# Altium schematic sheet Computation.SchDoc
size A4; SheetNumber: 1; SheetTotal: 2
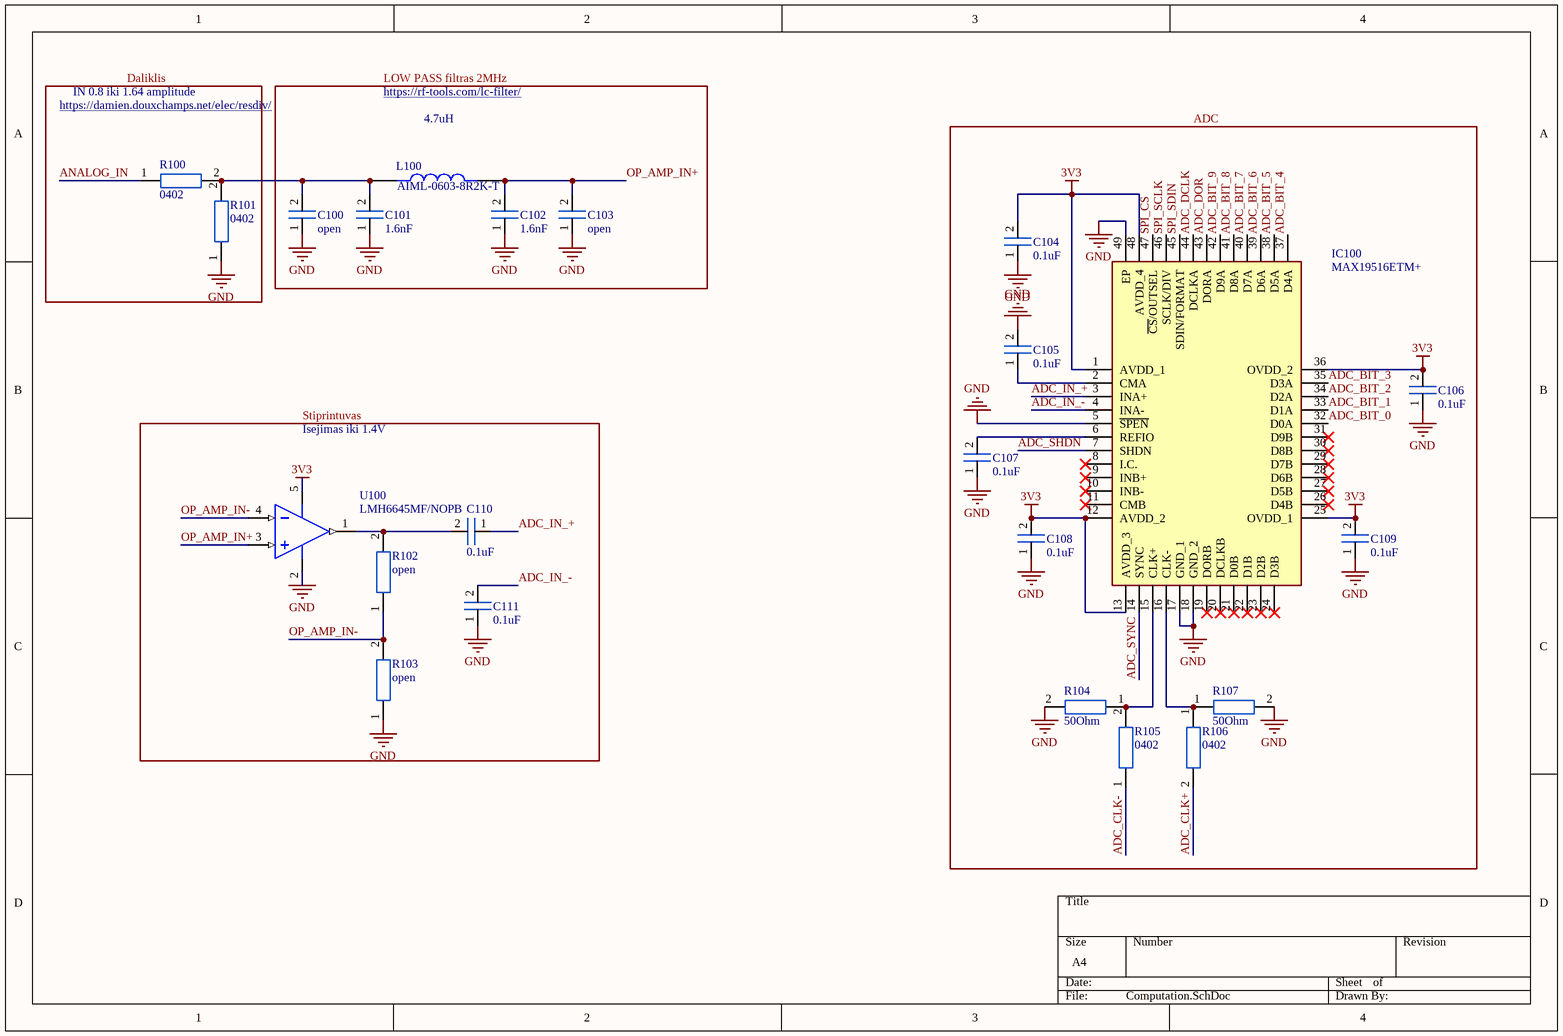
[diagram p0: Computation.SchDoc]

## Parts
C100  open  [0402_footprint]
C101  1.6nF  [0402_footprint]
C102  1.6nF  [0402_footprint]
C103  open  [0402_footprint]
C104  0.1uF  [0402_footprint]
C105  0.1uF  [0402_footprint]
C106  0.1uF  [0402_footprint]
C107  0.1uF  [0402_footprint]
C108  0.1uF  [0402_footprint]
C109  0.1uF  [0402_footprint]
C110  0.1uF  [0402_footprint]
C111  0.1uF  [0402_footprint]
IC100  MAX19516ETM+  [QFN50P700X700X80-49N]
L100  AIML-0603-8R2K-T  [INDC1608X95N]
R100  0402  [0402_footprint]
R101  0402  [0402_footprint]
R102  open  [0402_footprint]
R103  open  [0402_footprint]
R104  50Ohm  [0402_footprint]
R105  0402  [0402_footprint]
R106  0402  [0402_footprint]
R107  50Ohm  [0402_footprint]
U100  LMH6645MF/NOPB  [DBV0005A_N]

## Blocks framed on the sheet
ADC: C104-C109 IC100 R104-R107

## Nets
3V3: C104.2 C106.2 C108.2 C109.2 IC100.1(AVDD_1) IC100.12(AVDD_2) IC100.13(AVDD_3) IC100.25(OVDD_1) IC100.36(OVDD_2) IC100.48(AVDD_4) U100.5(V+)
GND: C100.1 C101.1 C102.1 C103.1 C104.1 C105.2 C106.1 C107.1 C108.1 C109.1 C111.1 IC100.5(~{SPEN}) IC100.17(GND_1) IC100.18(GND_2) IC100.49(EP) R101.1 R103.1 R104.2 R107.2 U100.2(V-)
ADC_BIT_0: IC100.32(D0A)
ADC_BIT_1: IC100.33(D1A)
ADC_BIT_2: IC100.34(D2A)
ADC_BIT_3: IC100.35(D3A)
ADC_BIT_4: IC100.37(D4A)
ADC_BIT_5: IC100.38(D5A)
ADC_BIT_6: IC100.39(D6A)
ADC_BIT_7: IC100.40(D7A)
ADC_BIT_8: IC100.41(D8A)
ADC_BIT_9: IC100.42(D9A)
ADC_CLK+: R106.2
ADC_CLK-: R105.1
ADC_DCLK: IC100.44(DCLKA)
ADC_DOR: IC100.43(DORA)
ADC_IN_+: C110.1 IC100.3(INA+)
ADC_IN_-: C111.2 IC100.4(INA-)
ADC_SHDN: IC100.7(SHDN)
ADC_SYNC: IC100.14(SYNC)
ANALOG_IN: R100.1
OP_AMP_IN+: C102.2 C103.2 L100.2 U100.3(IN+)
OP_AMP_IN-: R102.1 R103.2 U100.4(IN-)
SPI_CS: IC100.47(~{CS}/OUTSEL)
SPI_SCLK: IC100.46(SCLK/DIV)
SPI_SDIN: IC100.45(SDIN/FORMAT)
NetC100_2: C100.2 C101.2 L100.1 R100.2 R101.2
NetC105_1: C105.1 IC100.2(CMA)
NetC107_2: C107.2 IC100.6(REFIO)
NetC110_2: C110.2 R102.2 U100.1(OUT)
NetIC100_15: IC100.15(CLK+) R104.1 R105.2
NetIC100_16: IC100.16(CLK-) R106.1 R107.1

Not connected (* = marked no-connect by the designer): IC100 8(I.C.)* 9(INB+)* 10(INB-)* 11(CMB)* 19(DORB)* 20(DCLKB)* 21(D0B)* 22(D1B)* 23(D2B)* 24(D3B)* 26(D4B)* 27(D5B)* 28(D6B)* 29(D7B)* 30(D8B)* 31(D9B)*

## Notes on the sheet
- https://damien.douxchamps.net/elec/resdiv/
- IN 0.8 iki 1.64 amplitude
- Daliklis
- LOW PASS filtras 2MHz
- https://rf-tools.com/lc-filter/
- 4.7uH
- Isejimas iki 1.4V
- Stiprintuvas

## Library data of the parts
C100-C111 = Capacitor_0402: 0402 capacitor
IC100 = MAX19516ETM+: Integrated Circuit; Manufacturer_Name: Maxim Integrated; Datasheet Link: https://datasheets.maximintegrated.com/en/ds/MAX19516.pdf; Height: 0.8mm; Manufacturer_Part_Number: MAX19516ETM+; Mouser Part Number: 700-MAX19516ETM; Mouser Price/Stock: https://www.mouser.co.uk/ProductDetail/Maxim-Integrated/MAX19516ETM%2b/?qs=1THa7WoU59FJ2JI%2FsSE3dA%3D%3D
L100 = AIML-0603-8R2K-T: 8.2 ÂµH Shielded Multilayer Inductor 4 mA 2.1Ohm Max 0603 (1608 Metric); MF: Abracon; Purchase-URL: https://pricing.snapeda.com/search/part/AIML-0603-8R2K-T/?ref=eda; Package: 1608 Taiyo Yuden; MP: AIML-0603-8R2K-T; Price: None; Availability: In Stock; Value: *; Check_prices: https://www.snapeda.com/parts/AIML-0603-8R2K-T/Abracon/view-part/?ref=eda; SnapEDA_Link: https://www.snapeda.com/parts/AIML-0603-8R2K-T/Abracon/view-part/?ref=snap
R100-R107 = Resistor_0402
U100 = CMP-0055-01245-3: 2.7V, 650uA, 65MHz, Rail-to-Rail Input and Output Amplifiers with Shutdown Option, 5-pin SOT-23, Pb-Free; Manufacturer: Texas Instruments; PowerWise: Y; PackageTopMarking: A68A*XTT; Package Reference: DBV0005A; PackageDescription: Molded SOT-23, .115 x .063 x .040 in Body, 5 Lead, .0375 in Pitch; ComponentLink1URL: http://www.ti.com/general/docs/lit/getliterature.tsp?genericPartNumber=LMH6645&fileType=pdf; CompType: Amplifiers; PinCount: 5; RoHS: Y; ComponentLink1Description: Datasheet URL